# EAGLE design DRIVER 5V (EAGLE 9.6.2)
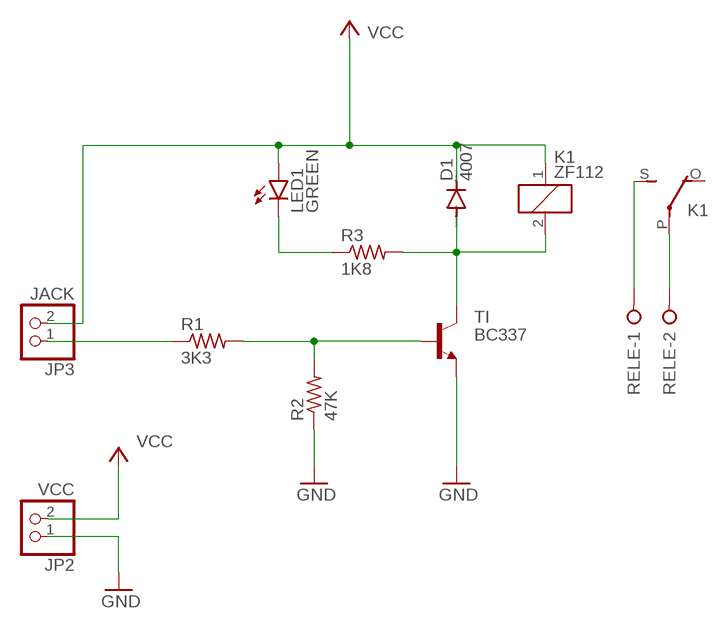
[diagram p0: schematic, sheet 1]

## Parts
D1  4007  1N4148DO35-10  [DO35-10]
JP2  VCC  PINHD-1X2  [1X02]
JP3  JACK  PINHD-1X2  [1X02]
K1  ZF112  [ZF112]
LED1  GREEN  LED5MM  [LED5MM]
R1  3K3  R-US_0207/10  [0207/10]
R2  47K  R-US_0207/10  [0207/10]
R3  1K8  R-US_0207/10  [0207/10]
RELE  W237-02P  [W237-132]
TI  BC337  2N4124-NPN-TO92-CBE  [TO92-CBE]

## Nets
GND: JP2.1 R2.1 TI.E
N$1: JP3.1 R1.1
N$2: R1.2 R2.2 TI.B
N$3: D1.A K1.2 R3.2 TI.C
N$4: LED1.K(C) R3.1
N$5: K1.S(2:S) RELE.1
N$6: K1.P(2:P) RELE.2
VCC: D1.C JP2.2 JP3.2 K1.1 LED1.A
Unconnected: K1.O(2:O)

## Library data of the parts
D1 = diode:1N4148: DIODE high speed (Philips)
JP2 JP3 = pinhead:PINHD-1X2: PIN HEADER
K1 = relay:ZF112: RELAY 1 x switch; OC_FARNELL: unknown; OC_NEWARK: unknown
LED1 = led:LED: LED OSRAM: - CHIPLED LG R971, LG N971, LY N971, LG Q971, LY Q971, LO R971, LY R971 LH N974, LH R974 LS Q976, LO Q976, LY Q976 LO Q996 - Hyper CHIPLED LW Q18S LB Q993, LB Q99A, LB R99A - SideLED LS A670, LO A670, LY A670, LG A670, LP A670 LB A673, LV A673, LT A673, LW A673 LH A674 LY A675 LS A676, LA A676, LO A676, LY A676, LW A676 LS A679, LY A679, LG A679 - Hyper Micro SIDELED® LS Y876, LA Y876, LO Y876, LY Y876 LT Y87S - SmartLED LW L88C, LW L88S LB L89C, LB L89S, LG L890 LS L89K, LO L89K, LY L89K LS L896, LA L896, LO L896, LY L896 - TOPLED LS T670, LO T670, LY T670, LG T670, LP T670 LSG T670, LSP T670, LSY T670, LOP T670, LYG T670 LG T671, LOG T671, LSG T671 LB T673, LV T673, LT T673, LW T673 LH T674 LS T676, LA T676, LO T676, LY T676, LB T676, LH T676, LSB T676, LW T676 LB T67C, LV T67C, LT T67C, LS T67K, LO T67K, LY T67K, LW E67C LS E67B, LA E67B, LO E67B, LY E67B, LB E67C, LV E67C, LT E67C LW T67C LS T679, LY T679, LG T679 LS T770, LO T770, LY T770, LG T770, LP T770 LB T773, LV T773, LT T773, LW T773 LH T774 LS E675, LA E675, LY E675, LS T675 LS T776, LA T776, LO T776, LY T776, LB T776 LHGB T686 LT T68C, LB T68C - Hyper Mini TOPLED® LB M676 - Mini TOPLED Santana® LG M470 LS M47K, LO M47K, LY M47K Source: http://www.osram.convergy.de LUXEON: - LUMILED® LXK2-PW12-R00, LXK2-PW12-S00, LXK2-PW14-U00, LXK2-PW14-V00 LXK2-PM12-R00, LXK2-PM12-S00, LXK2-PM14-U00 LXK2-PE12-Q00, LXK2-PE12-R00, LXK2-PE12-S00, LXK2-PE14-T00, LXK2-PE14-U00 LXK2-PB12-K00, LXK2-PB12-L00, LXK2-PB12-M00, LXK2-PB14-N00, LXK2-PB14-P00, LXK2-PB14-Q00 LXK2-PR12-L00, LXK2-PR12-M00, LXK2-PR14-Q00, LXK2-PR14-R00 LXK2-PD12-Q00, LXK2-PD12-R00, LXK2-PD12-S00 LXK2-PH12-R00, LXK2-PH12-S00 LXK2-PL12-P00, LXK2-PL12-Q00, LXK2-PL12-R00 Source: www.luxeon.com KINGBRIGHT: KA-3528ASYC Source: www.kingbright.com
R1-R3 = rcl:R-US_: RESISTOR, American symbol; SPICEPREFIX: R
RELE = con-wago-508:W237-02P: WAGO SREW CLAMP; OC_FARNELL: unknown; OC_NEWARK: unknown
TI = transistor:*-NPN-: NPN Transistror BF959 corrected 2008.03.06

## Board
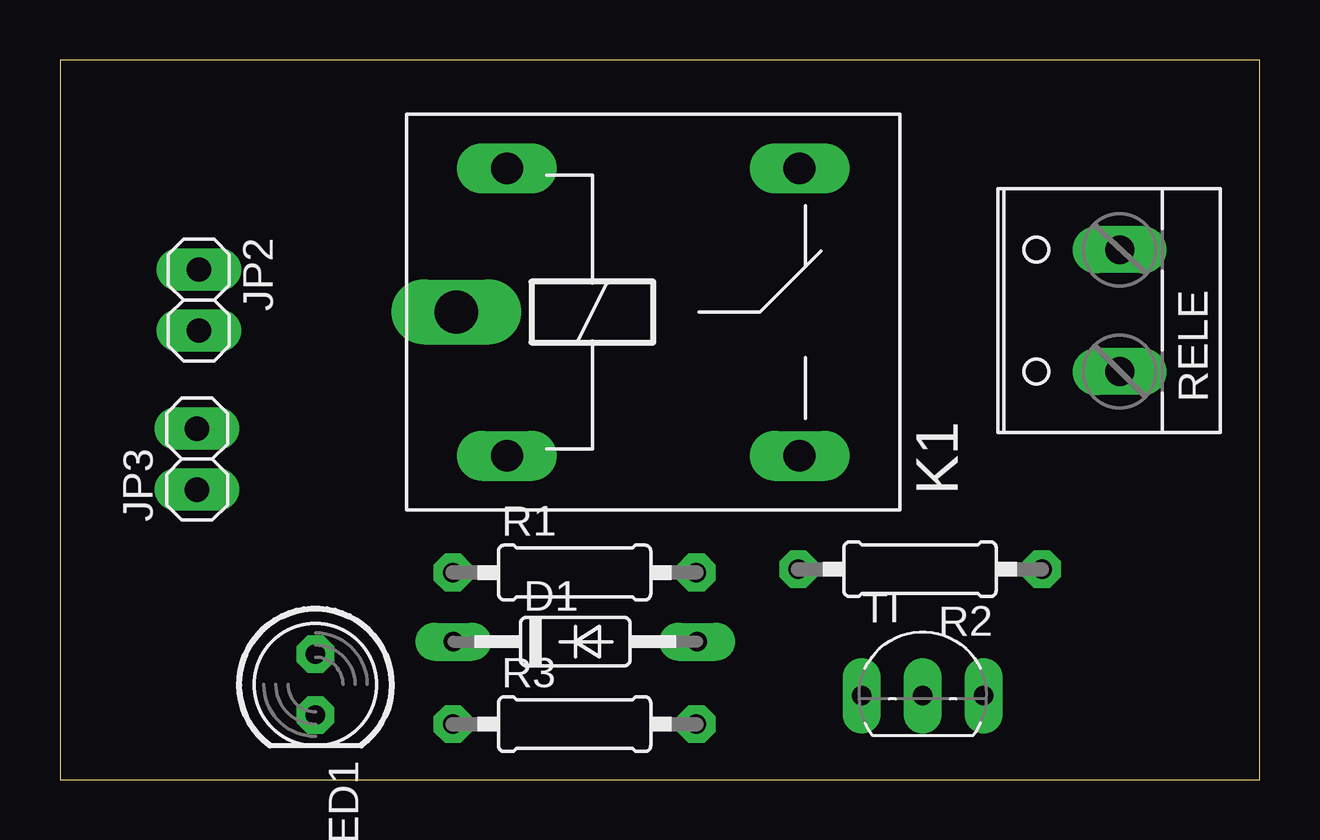
[diagram p1: board, top side]
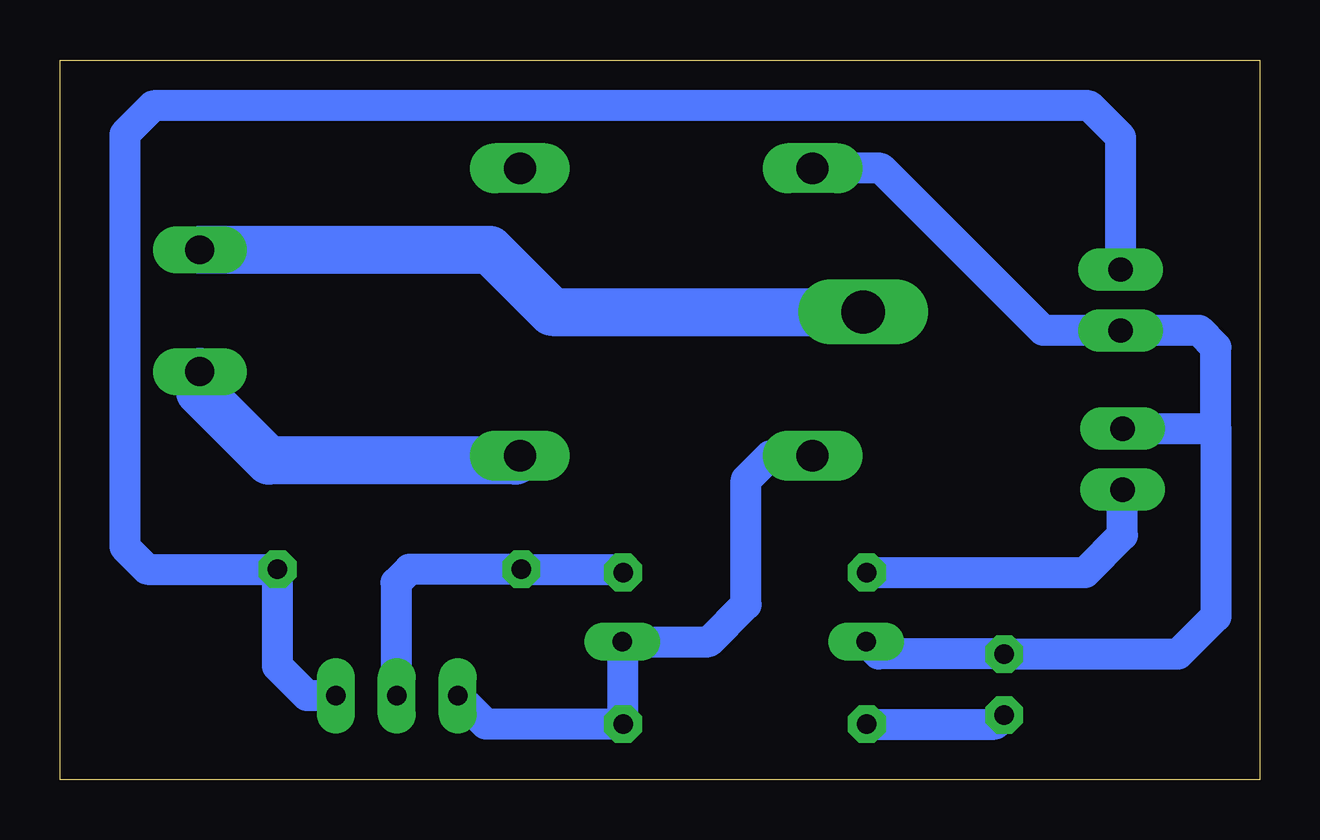
[diagram p2: board, bottom side, seen from below]

Size 50 x 30 mm. Coordinates in mm from the lower left corner, seen from the top.
Outline: 0,0 50,0 50,30 0,30 0,0
Copper layers (1*16): Top 0.035mm / dielectric 1.5mm / Bottom 0.035mm
Design rules "default *": minimum track width 6mil, minimum drill 0.35mm, track to track 6mil, track to pad 6mil, pad to pad 6mil, via to via 6mil, smd to smd 6mil, copper to edge 1mm, drill to drill 6mil, minimum pad ring 15mil, minimum via ring 8mil, stop-mask expansion 4mil, vias tented up to drill 0mil, thermal gap 10mil

### Footprints (pad centres in the part's own frame; a part is rotated, then mirrored left to right if it is on the bottom)
DO35-10 = drill 0.813 long: A 5.08,0; C -5.08,0
1X02 = drill 1.016 long: 1 -1.27,0; 2 1.27,0
ZF112 = drill 1.321 long: 1 -6.096,5.994; 2 -6.096,-5.994; O 6.096,5.994; S 6.096,-5.994 | drill 1.803 long: P -8.204,0
LED5MM = drill 0.813 octagon: A -1.27,0; K 1.27,0
0207/10 = drill 0.813 octagon: 1 -5.08,0; 2 5.08,0
W237-132 = drill 1.194 long: 1 -2.54,-0.635; 2 2.54,-0.635
TO92-CBE = drill 0.813 long: B 0,0; C -2.54,0; E 2.54,0

### Placement (x,y rotation side)
D1  21.48,5.75 0 top
JP2  5.79,19.99 270 top
JP3  5.71,13.36 90 top
K1  24.73,19.49 0 top
LED1  10.65,3.96 270 top
R1  21.45,8.63 0 top
R2  35.85,8.77 180 top
R3  21.45,2.31 0 top
RELE  43.54,19.55 90 top
TI  35.96,3.49 0 top

### Tracks (layer width: path | path; a pad name or v marks a point on that pad's centre or on a via)
GND
  Bottom 1.3: TI.E 39.7,3.49 40.93,4.72 R2.1 46.37,8.77 47.3,9.7 47.3,26.9 46.12,28.08 7.1,28.08 5.79,26.77 JP2.1
N$1
  Bottom 1.3: R1.1 7.27,8.63 5.71,10.19 JP3.1
N$2
  Bottom 1: 26.67,8.77 R1.2 | 36,3.53 TI.B
  Bottom 1.3: 26.67,8.77 R2.2 35.43,8.77 36,8.2 36,3.53
N$3
  Bottom 1: 26.56,2.34 R3.2
  Bottom 1.3: R3.2 32.24,2.31 TI.C | 26.56,2.34 D1.A 22.95,5.75 21.4,7.3 21.4,12.5 20.4,13.5 K1.2
N$4
  Bottom 1.3: R3.1 11.03,2.31 LED1.K
N$5
  Bottom 2: K1.S 31.02,13.3 41.3,13.3 44.17,16.18 RELE.1
N$6
  Bottom 2: RELE.2 32.09,22.09 29.49,19.49 K1.P
VCC
  Bottom 1.3: K1.1 15.78,25.48 9.02,18.72 JP2.2 2.52,18.72 1.82,18.02 1.82,14.63 | 1.82,14.63 1.82,6.8 3.39,5.23 LED1.A 15.88,5.23 D1.C | JP3.2 1.82,14.63